# Altium schematic sheet filter-rf.SchDoc: RF Filter
size Letter; CheckedBy: J. Brinton; CompanyName: Signal Laboratories, Inc.; DrawnBy: J. Brinton; Engineer: J. Brinton; Address1: 3479 Edison Way; Address2: Menlo Park CA 94025; Address3: +1 (877) 778-8435; Address4: siglabs.com; Revision: 3; SheetNumber: 10; SheetTotal: 49; ModifiedDate: 4/20/2018
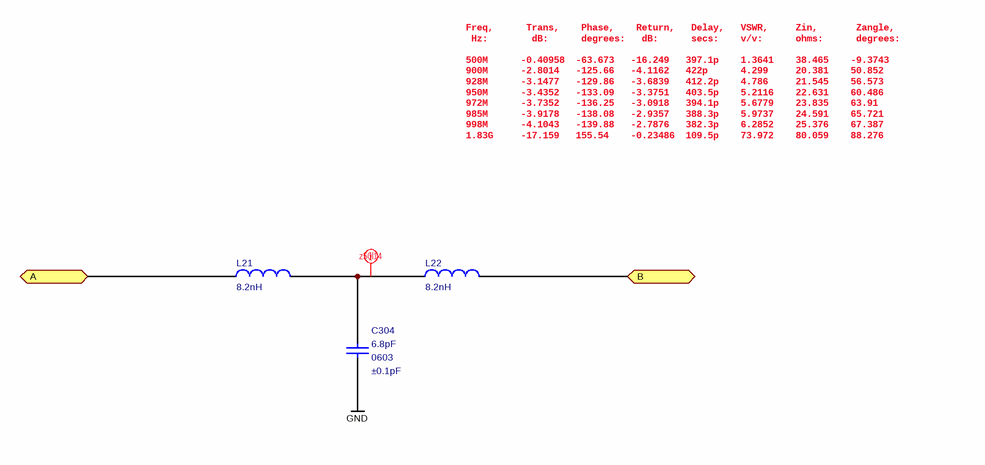
[diagram p0: filter-rf.SchDoc]

## Parts
C304  value 6.8pF  Tolerance: ±0.1pF  Package: 0603  [CAPC160X80X90L20N]  (hidden comment: 06032U6R8BAT2A)
L21  value 8.2nH  [0603]  (hidden comment: LQW18AN8N2G8ZD)
L22  value 8.2nH  [0603]  (hidden comment: LQW18AN8N2G8ZD)

## Ports
A (bidir), B (bidir)

## Nets
GND: C304.1
A: L21.1 ; port A
B: L22.2 ; port B
NetC304_2: C304.2 L21.2 L22.1

## Layout directives
net class z50l14: NetC304_2

## Notes on the sheet
- Freq,      Trans,    Phase,    Return,   Delay,   VSWR,     Zin,       Zangle,
  Hz:        dB:      degrees:   dB:      secs:    v/v:      ohms:      degrees:
  500M      -0.40958  -63.673   -16.249   397.1p    1.3641    38.465    -9.3743
  900M      -2.8014   -125.66   -4.1162   422p      4.299     20.381    50.852
  928M      -3.1477   -129.86   -3.6839   412.2p    4.786     21.545    56.573
  950M      -3.4352   -133.09   -3.3751   403.5p    5.2116    22.631    60.486
  972M      -3.7352   -136.25   -3.0918   394.1p    5.6779    23.835    63.91
  985M      -3.9178   -138.08   -2.9357   388.3p    5.9737    24.591    65.721
  998M      -4.1043   -139.88   -2.7876   382.3p    6.2852    25.376    67.387
  1.83G     -17.159   155.54    -0.23486  109.5p    73.972    80.059    88.276
- Title
- Engineer
- Revision
- Drawn By
- Checked By
- Date
- Sheet
- of

## Library data of the parts
C304 = CAP: Ceramic Capacitor 6.8pF ±0.1pF NP0 0603; Manufacturer: AVX; Voltage: 200V; Tr: -55"125; Manufacturer P/N: 06032U6R8BAT2A
L21 L22 = INDUCTOR: Inductor 8.2nH ±2%; Manufacturer: Murata; Manufacturer P/N: LQW18AN8N2G8ZD